# Altium project IrDA2TTLBoard.PrjPcb
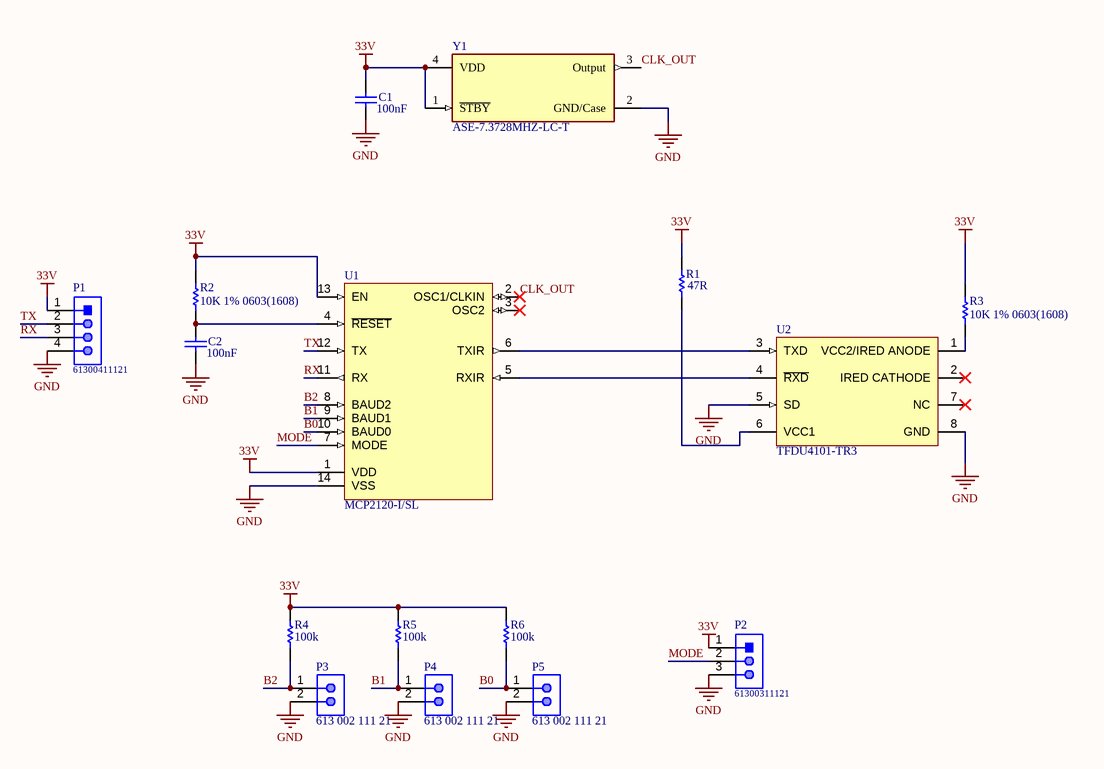
[diagram p0: IrDA2TTLBoard.SchDoc]
1 sheet, 16 parts. Net scope: global (net labels, ports and power ports of the same name join across sheets).
Board file: IrDA2TTLBoard.PcbDoc

## Sheet IrDA2TTLBoard.SchDoc
size A4; SheetNumber: 1; SheetTotal: 1

### Parts
C1  value 100nF  [CAPC0603(1608)100_M]  (hidden comment: CAP 100nF 6.3V 0603(1608))
C2  value 100nF  [CAPC0603(1608)100_M]  (hidden comment: CAP 100nF 6.3V 0603(1608))
P1  61300411121  [61300411121]
P2  61300311121  [61300311121]
P3  613 002 111 21  [WE-61300211121_V]
P4  613 002 111 21  [WE-61300211121_V]
P5  613 002 111 21  [WE-61300211121_V]
R1  value 47R  [RESC1609X50X30LL10T20]  (hidden comment: CRCW060347R0FKEA)
R2  10K 1% 0603(1608)  [RESC0603(1608)_N]
R3  10K 1% 0603(1608)  [RESC0603(1608)_N]
R4  value 100k  [RESC1609X50X30LL10T20]  (hidden comment: CRCW0603100KJNEA)
R5  value 100k  [RESC1609X50X30LL10T20]  (hidden comment: CRCW0603100KJNEA)
R6  value 100k  [RESC1609X50X30LL10T20]  (hidden comment: CRCW0603100KJNEA)
U1  MCP2120-I/SL  [SOIC-SL14_N]
U2  TFDU4101-TR3  [VISH-TFDU4100_4101-TR3_V]
Y1  ASE-7.3728MHZ-LC-T  [FP-ASE-MFG]

### Nets
33V: C1.2 P1.1 P2.1 R1.2 R2.2 R3.2 R4.2 R5.2 R6.2 U1.1(VDD) U1.13(EN) Y1.1(~{STBY}) Y1.4(VDD)
GND: C1.1 C2.1 P1.4 P2.3 P3.2 P4.2 P5.2 U1.14(VSS) U2.5(SD) U2.8(GND) Y1.2(GND/Case)
B0: P5.1 R6.1 U1.10(BAUD0)
B1: P4.1 R5.1 U1.9(BAUD1)
B2: P3.1 R4.1 U1.8(BAUD2)
CLK_OUT: U1.2(OSC1/CLKIN) Y1.3(Output)
MODE: P2.2 U1.7(MODE)
RX: P1.3 U1.11(RX)
TX: P1.2 U1.12(TX)
NetC2_2: C2.2 R2.1 U1.4(~{RESET})
NetR1_1: R1.1 U2.6(VCC1)
NetR3_1: R3.1 U2.1(VCC2/IRED_ANODE)
NetU1_5: U1.5(RXIR) U2.4(~{RXD})
NetU1_6: U1.6(TXIR) U2.3(TXD)

Not connected (* = marked no-connect by the designer): U1 3(OSC2)*; U2 2(IRED_CATHODE)* 7(NC)*

### Notes on the sheet
- DWG. NO.
- REV.
- SHT.
- REVISION
- DESCRIPTION
- DATE
- APPROVED
- THIS DOCUMENT AND THE DATA DISCLOSED HEREIN OR HEREWITH IS THE PROPERTY OF ALTIUM LIMITED AND MAY BE FREELY DISTRIBUTED IN WHOLE. NO RIGHTS ARE RESERVED OR EXPRESS OR IMPLIED WARANTEE GIVEN.
- ENG:
- DSN:
- APPROVALS
- PROJECT
- DOCUMENT REVISION:
- DESIGN ITEM:
- CHK:
- BOM:
- REFERENCE DOCUMENTS
- PROJECT REVISION:
- TITLE
- FAB DWG:
- PCB DWG:
- ASSY DWG:
- SCALE:
- SIZE
- C
- CAGE CODE
- FILE NAME
- DWG NO.
- SHEET
- OF
- REV

### Library data of the parts
C1 C2 = CMP-1035-02576-1: CAP 100nF 6.3V ±10% 0603 (1608 Metric) Thickness 1mm SMD; Tolerance: Â±10%; Case-Metric: 1608; Case-EIA: 0603; Max Thickness: 1 mm; Rated Voltage: 6.3 V; Technology: SMT
P1 = CMP-1502-01064-1: THT Vertical Pin Header WR-PHD, Pitch 2.54 mm, Single Row, 4 pins; Manufacturer: Wurth Elektronik; Withstanding Voltage: 500VAC; Rated Current: 3A; Working Voltage: 250VAC; Pin Number: 4; Gender: Male; Contact Resistance: 20mOhm; Pitch: 2.54mm; Manufacturer URL: http://www.we-online.de; Operating Temperature: -40to105degC; Packaging: Bag; Mounting Technology: THT; Package Reference: 61300411121; Datasheet URL: https://katalog.we-online.de/em/datasheet/6130xx11121.pdf; Publisher: WurthElektronik; Part Number: 61300411121; Row Number: Single; Orientation: Vertical
P2 = CMP-1502-01062-1: THT Vertical Pin Header WR-PHD, Pitch 2.54 mm, Single Row, 3 pins; Manufacturer: Wurth Elektronik; Withstanding Voltage: 500VAC; Working Voltage: 250VAC; Rated Current: 3A; Pitch: 2.54mm; Pin Number: 3; Gender: Male; Contact Resistance: 20mOhm; Package Reference: 61300311121; Manufacturer URL: http://www.we-online.de; Datasheet URL: https://katalog.we-online.de/em/datasheet/6130xx11121.pdf; Operating Temperature: -40to105degC; Part Number: 61300311121; Orientation: Vertical; Packaging: Bag; Row Number: Single; Mounting Technology: THT; Publisher: WurthElektronik
P3-P5 = CMP-1712-00002-3: Male Header, Pitch 2.54 mm, 1 x 2 Position, Height 8.54 mm, Tail Length 3 mm, -40 to 105 degC, RoHS, Bulk; Mounting Technology: Through Hole; Packaging: Bulk; Pins: 2; REACH SVHC: No SVHC; PartNumber: 613 002 111 21; PackageDescription: Male Header, Pitch 2.54 mm, 1 x 2 Position, Height 8.54 mm, Tail Length 3 mm; ComponentLink1Description: Manufacturer URL; Max Operating Temperature: 125 degC; ComponentLink1URL: https://www.we-online.com/; ComponentLink2Description: Datasheet; Mount: Through Hole; DatasheetVersion: Rev. J; Min Operating Temperature: -40 degC; ComponentLink2URL: http://katalog.we-online.de/em/datasheet/6130xx11121.pdf; RoHSCompliant: True
R1 = CMP-2000-03383-1: Manufacturer: Vishay Dale; Part Number: CRCW060347R0FKEA
R2 R3 = CMP-1012-00623-1: 10K 0.1W 1% 0603 (1608 Metric)  SMD; Value: 10000.00 Ohm; Case-EIA: 0603; Case-Metric: 1608; Power: 0.1 W; Tolerance: 1 %; Technology: SMT
R4-R6 = CMP-2000-03823-1: Manufacturer: Vishay Dale; Part Number: CRCW0603100KJNEA
U1 = CMP-0186-00156-2: Infrared Encoder/Decoder, 14-Pin SOIC, Industrial Temperature; ComponentLink1URL: http://www.microchip.com/; RevisionNote: URLs added.; PackageVersion: revBB, Aug-2009; PackageReference: SOIC-SL14; DatasheetVersion: revB, Feb-2007; ComponentLink3Description: Package Specification; ComponentLink2Description: Datasheet; ComponentLink1Description: Manufacturer URL; PackageDescription: 14-Lead Plastic Small Outline (SL) - Narrow, 3.90mm Body [SOIC]; Code_IPC: SOIC127P600-14; ComponentLink3URL: http://www.microchip.com/stellent/groups/techpub_sg/documents/packagingspec/en012702.pdf; Code_JEDEC: MS-012-AB; ComponentLink2URL: http://ww1.microchip.com/downloads/en/DeviceDoc/21618b.pdf
U2 = CMP-0726-00002-1: Infrared Transceiver Module, SIR, 115.2 kbit/s, 2.4 to 5.5 V, -30 to 85 degC, 9.9 x 4.7 x 4.2 mm SMD Side View, RoHS, Tape and Reel; Manufacturer: Vishay Semiconductor; Idle Supply Current: 0.07 mA; Link Distance: 0 to >=1 m; Data Rate: 115.2 kbit/s; Packing: Tape and Reel; ComponentLink1Description: Manufacturer URL; IRDA Std.: SIR; Mounting Technology: Surface Mount; ComponentLink3Description: Package Specification; PackageReference: TFDU4100_4101-TR3; PackageVersion: Rev.1.6; ComponentLink1URL: http://www.vishay.com/; Operating Voltage: 2.4 to 5.5 V; ComponentLink2Description: Datasheet; PackageDescription: 8-Pin SMD Side View, Body 9.9 x 4.7 x 4 mm, Pitch 1 mm; ComponentLink2URL: http://www.vishay.com/docs/81288/tfdu4101.pdf; RoHS: TRUE; ComponentLink3URL: http://www.vishay.com/docs/81288/tfdu4101.pdf; Ambient Temperature Range: -30 to 85 degC; PartNumber: TFDU4101-TR3; DatasheetVersion: Rev. 1.6
Y1 = CMP-27762-000889-1: XTAL Oscillator 7.3728MHz ±50ppm CMOS 3.3V 4-SMD 3.2mm x 2.5mm; Load Capacitance: 15pF; Max Supply Voltage: 3.465V; Min Supply Voltage: 3.135V; Max Supply Current: 7mA; Width: 0.098inch; Case/Package: SMD/SMT; Depth: 2.5mm; Number of Pins: 4; Radiation Hardening: No; Frequency: 7.3728MHz; Frequency Stability: 50ppm; Max Operating Temperature: 85°C; Height: 0.047inch; Package Quantity: 1000; Mount: Surface Mount; Operating Supply Voltage: 3.3V; Packaging: Tape and Reel; Operating Frequency: 7.3728 MHz; Lead Free: Lead Free; Termination: SMD/SMT; Series: ASE; Length: 3.2mm; Min Operating Temperature: -40°C; REACH SVHC: No SVHC